# EAGLE design nrf52832bob (EAGLE 7.4.0)
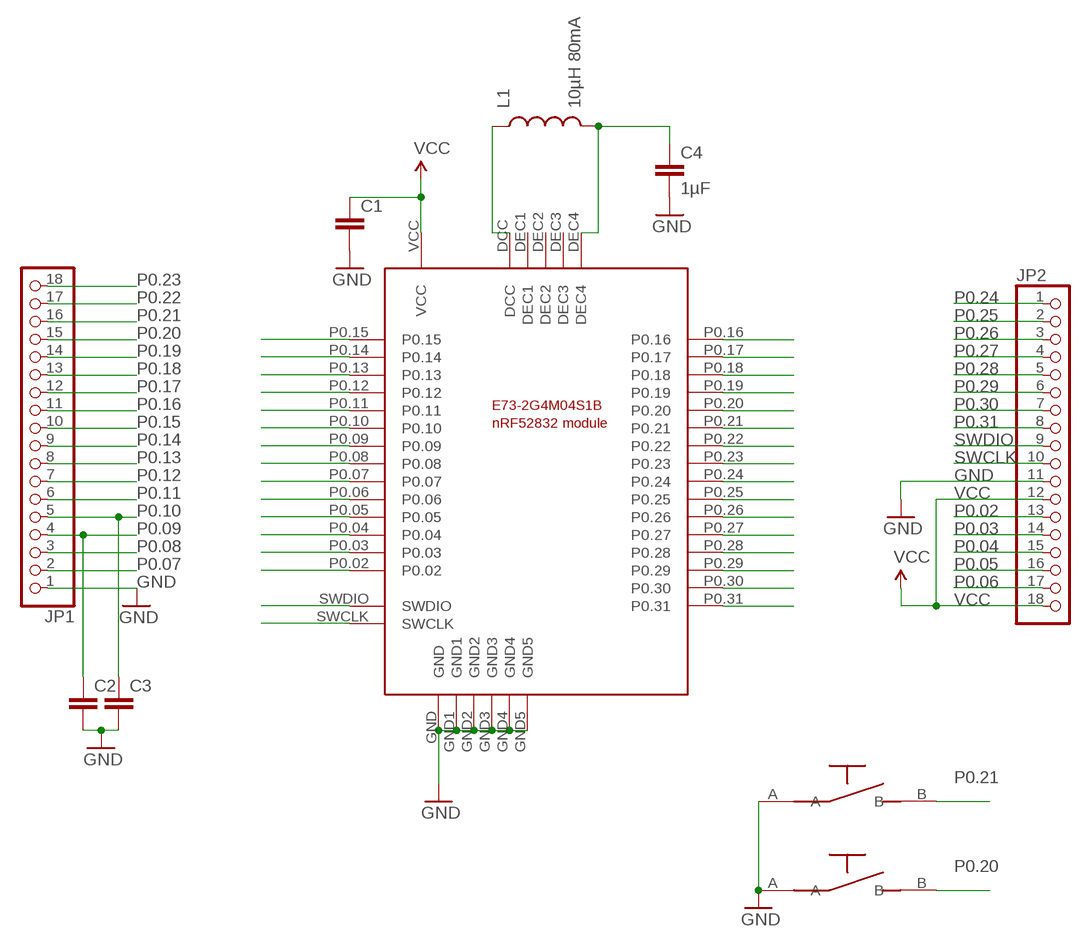
[diagram p0: schematic, sheet 1]

## Parts
C1  C-EUC0805  [C0805]
C2  C-EUC0603  [C0603]
C3  C-EUC0603  [C0603]
C4  1µF  C-EUC0603  [C0603]
JP1  PINHD-1X18-BIG  [1X18-BIG]
JP2  PINHD-1X18-BIG  [1X18-BIG]
L1  10µH 80mA  INDUCTOR0603  [0603]
U$1  NRF52832MODULE  [NRF52832MODULE]
U$2  SWITCH2PIN  [SWITCH2PIN]
U$3  SWITCH2PIN  [SWITCH2PIN]

## Nets
GND: C1.2 C2.2 C3.2 C4.2 JP1.1 JP2.11 U$1.GND U$1.GND1 U$1.GND2 U$1.GND3 U$1.GND4 U$1.GND5 U$2.A U$3.A
N$1: L1.1 U$1.DCC
N$2: C4.1 L1.2 U$1.DEC4
P0.02: JP2.13 U$1.P0.02
P0.03: JP2.14 U$1.P0.03
P0.04: JP2.15 U$1.P0.04
P0.05: JP2.16 U$1.P0.05
P0.06: JP2.17 U$1.P0.06
P0.07: JP1.2 U$1.P0.07
P0.08: JP1.3 U$1.P0.08
P0.09: C2.1 JP1.4 U$1.P0.09
P0.10: C3.1 JP1.5 U$1.P0.10
P0.11: JP1.6 U$1.P0.11
P0.12: JP1.7 U$1.P0.12
P0.13: JP1.8 U$1.P0.13
P0.14: JP1.9 U$1.P0.14
P0.15: JP1.10 U$1.P0.15
P0.16: JP1.11 U$1.P0.16
P0.17: JP1.12 U$1.P0.17
P0.18: JP1.13 U$1.P0.18
P0.19: JP1.14 U$1.P0.19
P0.20: JP1.15 U$1.P0.20 U$3.B
P0.21: JP1.16 U$1.P0.21 U$2.B
P0.22: JP1.17 U$1.P0.22
P0.23: JP1.18 U$1.P0.23
P0.24: JP2.1 U$1.P0.24
P0.25: JP2.2 U$1.P0.25
P0.26: JP2.3 U$1.P0.26
P0.27: JP2.4 U$1.P0.27
P0.28: JP2.5 U$1.P0.28
P0.29: JP2.6 U$1.P0.29
P0.30: JP2.7 U$1.P0.30
P0.31: JP2.8 U$1.P0.31
SWCLK: JP2.10 U$1.SWCLK
SWDIO: JP2.9 U$1.SWDIO
VCC: C1.1 JP2.12 JP2.18 U$1.VCC
Unconnected: U$1.DEC1 U$1.DEC2 U$1.DEC3

## Library data of the parts
C1-C4 = rcl:C-EU: CAPACITOR, European symbol
JP1 JP2 = adafruit:PINHD-1X18: PIN HEADER
L1 = SparkFun-Passives:INDUCTOR: Inductors Basic Inductor/Choke - 0603 and 1206. Footprints are not proven and vary greatly between part numbers. INDUCTOR POWER 3.3UH 4.0A SMD 0.197" L x 0.197" W x 0.177" H (5.00mm x 5.00mm x 4.50mm)
U$1 = nrf52832module:NRF52832MODULE
U$2 U$3 = switch2pin:SWITCH2PIN

## Board
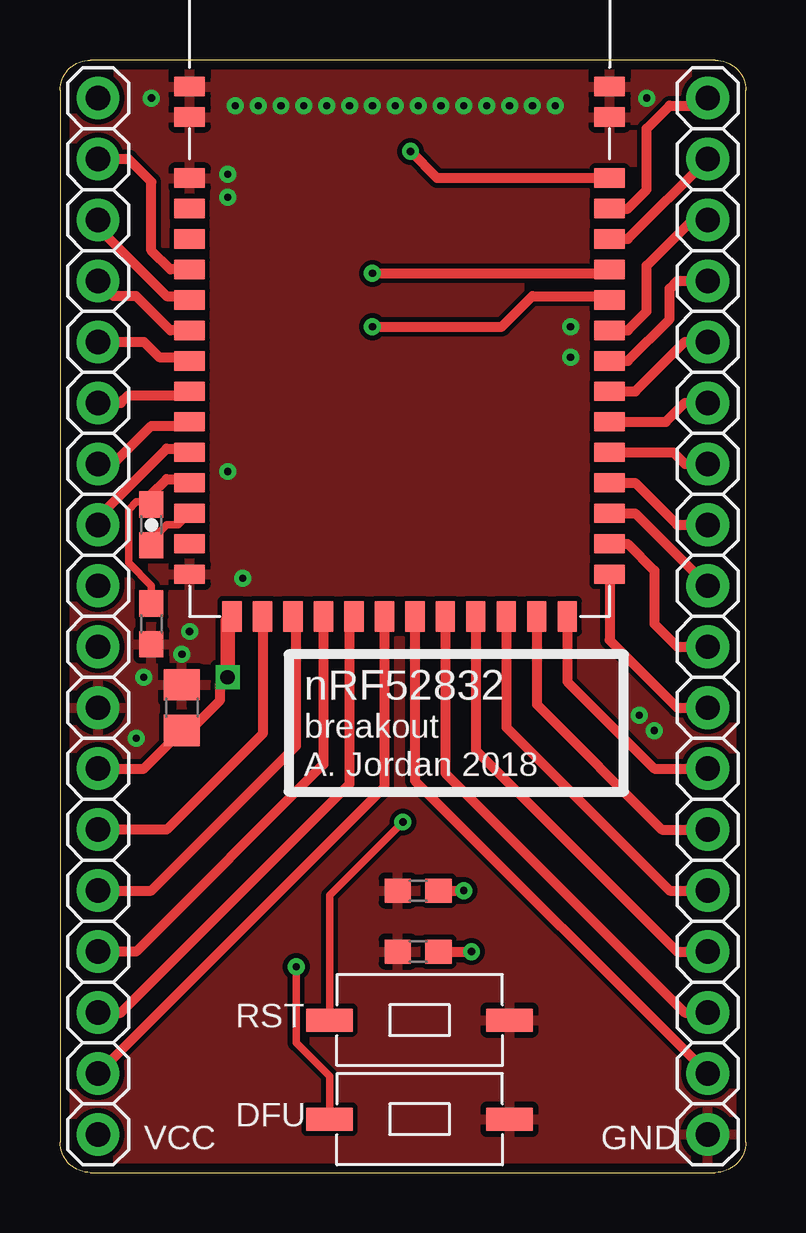
[diagram p1: board, top side]
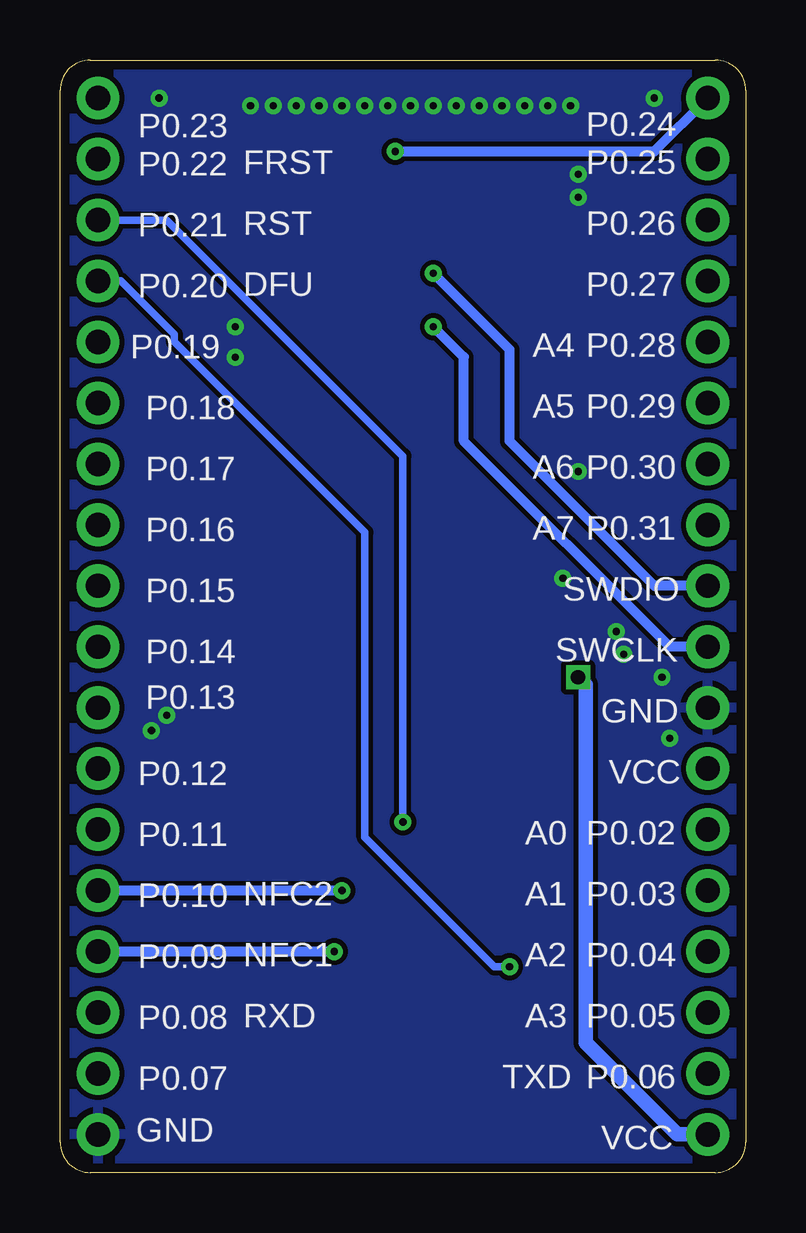
[diagram p2: board, bottom side, seen from below]

Size 28.57 x 46.35 mm. Coordinates in mm from the lower left corner, seen from the top.
Outline: 1.27,0 27.31,0 arc90 28.57,1.27 28.57,45.09 arc90 27.31,46.35 1.27,46.35 arc90 0,45.09 0,1.27 arc90 1.27,0
Copper layers (1*16): Top 0.035mm / dielectric 1.5mm / Bottom 0.035mm
Design rules "default *": minimum track width 10mil, minimum drill 24mil, track to track 8mil, track to pad 8mil, pad to pad 8mil, via to via 8mil, smd to smd 8mil, copper to edge 15mil, drill to drill 8mil, minimum pad ring 10mil, minimum via ring 8mil, stop-mask expansion 4mil, vias tented up to drill 20mil, thermal gap 10mil

### Footprints (pad centres in the part's own frame; a part is rotated, then mirrored left to right if it is on the bottom)
C0805 = smd 1.3 x 1.5: 1 -0.95,0; 2 0.95,0
C0603 = smd 1.1 x 1: 1 -0.85,0; 2 0.85,0
1X18-BIG = drill 1.016 pad 1.778: 1 -21.59,0; 2 -19.05,0; 3 -16.51,0; 4 -13.97,0; 5 -11.43,0; 6 -8.89,0; 7 -6.35,0; 8 -3.81,0; 9 -1.27,0; 10 1.27,0; 11 3.81,0; 12 6.35,0; 13 8.89,0; 14 11.43,0; 15 13.97,0; 16 16.51,0; 17 19.05,0; 18 21.59,0
0603 = smd 1.1 x 1: 1 -0.85,0; 2 0.85,0
NRF52832MODULE = smd 1.27 x 0.8: DCC 0,4.29; DEC1 0,3.02; DEC2 0,16.99; DEC3 0,15.72; DEC4 0,5.56; GND 0,22.07; GND1 0,20.8; GND2 0,18.26; GND3 0,1.75; GND4 17.5,20.8; GND5 17.5,22.07; P0.13 17.5,1.75; P0.14 17.5,3.02; P0.15 17.5,4.29; P0.16 17.5,5.56; P0.17 17.5,6.83; P0.18 17.5,8.1; P0.19 17.5,9.37; P0.20 17.5,10.64; P0.21 17.5,11.91; P0.22 17.5,15.72; P0.23 17.5,16.99; P0.24 17.5,18.26; P0.25 0,14.45; P0.26 0,13.18; P0.27 0,11.91; P0.28 0,10.64; P0.29 0,9.37; P0.30 0,8.1; P0.31 0,6.83; SWCLK 17.5,13.18; SWDIO 17.5,14.45 | smd 0.8 x 1.27: P0.02 3.04,0; P0.03 4.31,0; P0.04 5.58,0; P0.05 6.85,0; P0.06 8.12,0; P0.07 9.39,0; P0.08 10.66,0; P0.09 11.93,0; P0.10 13.2,0; P0.11 14.47,0; P0.12 15.74,0; VCC 1.77,0
SWITCH2PIN = smd 1.93 x 0.965: A 0,0; B 7.5,0

### Placement (x,y rotation side)
C1  5.08,19.37 90 top
C2  14.92,9.21 180 top
C3  14.92,11.75 180 top
C4  3.81,22.86 270 top
JP1  26.99,23.18 90 top
JP2  1.59,23.18 270 top
L1  3.81,26.99 90 top
U$1  5.4,23.18 0 top
U$2  18.73,6.35 180 top
U$3  18.73,2.22 180 top

### Tracks (layer width: path | path; a pad name or v marks a point on that pad's centre or on a via)
GND  (via drill 0.3)
  other vias: 7.3,44.45 8.25,44.45 9.21,44.45 10.16,44.45 11.11,44.45 12.06,44.45 13.02,44.45 13.97,44.45 14.92,44.45 15.88,44.45 16.83,44.45 17.78,44.45 18.73,44.45 19.68,44.45 20.64,44.45 24.45,44.77 3.81,44.77 3.18,18.1 5.4,22.54 7.62,24.77 6.99,29.21 24.13,19.05 24.77,18.41 21.27,35.24 21.27,33.97 6.99,41.59 6.99,40.64 5.08,21.59 3.49,20.64
  pour Bottom: -0.95,46.67 -1.59,46.67 -1.59,-1.9 29.53,-1.9 29.53,46.35 29.53,46.67
  pour Top: -2.86,47.62 -3.18,47.62 -3.18,-2.86 31.12,-2.86 31.12,46.99 31.12,47.62
N$1
  Top 0.305: L1.1 3.81,26.35 4.44,26.99 4.92,26.99 U$1.DCC
N$2
  Top 0.305: C4.1 3.81,24.45 2.86,25.4 2.86,27.62 3.18,27.94 3.71,27.94 L1.2
  Top 0.406: L1.2 3.81,28.26 4.44,28.89 5.24,28.89 U$1.DEC4
P0.02
  Top 0.406: U$1.P0.02 8.44,18.28 4.44,14.29 JP2.13 | JP2.13 1.27,14.29 0.95,13.97 1.27,13.97 JP2.13
P0.03
  Top 0.406: JP2.14 3.81,11.75 9.84,17.78 9.84,23.04 U$1.P0.03
P0.04
  Top 0.406: U$1.P0.04 10.98,17.01 3.18,9.21 JP2.15
P0.05
  Top 0.406: JP2.16 2.54,6.67 12.07,16.19 12.07,22.99 U$1.P0.05
P0.06
  Top 0.406: U$1.P0.06 13.52,16.06 JP2.17
P0.07
  Top 0.406: U$1.P0.07 14.79,16.33 JP1.2
P0.08
  Top 0.406: U$1.P0.08 16.06,16.65 26.04,6.67 JP1.3
P0.09  (via drill 0.3)
  Top 0.406: U$1.P0.09 17.33,17.6 25.72,9.21 JP1.4 | C2.1 v17.15,9.21
  Bottom 0.406: v17.15,9.21 JP1.4
P0.10  (via drill 0.3)
  Top 0.406: U$1.P0.10 18.6,18.55 25.4,11.75 JP1.5 | C3.1 v16.83,11.75
  Bottom 0.406: v16.83,11.75 JP1.5
P0.11
  Top 0.406: U$1.P0.11 19.87,19.5 25.08,14.29 JP1.6
P0.12
  Top 0.406: U$1.P0.12 21.14,20.45 24.77,16.83 JP1.7
P0.13
  Top 0.406: U$1.P0.13 22.9,22.19 25.72,19.37 JP1.8
P0.14
  Top 0.406: U$1.P0.14 23.65,26.2 24.77,25.08 24.77,22.86 25.72,21.91 JP1.9
P0.15
  Top 0.406: U$1.P0.15 23.97,27.47 JP1.10
P0.16
  Top 0.406: U$1.P0.16 23.97,28.74 25.72,26.99 JP1.11
P0.17
  Top 0.406: U$1.P0.17 25.56,30.01 26.04,29.53 JP1.12
P0.18
  Top 0.406: U$1.P0.18 25.25,31.28 26.04,32.07 JP1.13
P0.19
  Top 0.406: U$1.P0.19 23.97,32.55 26.04,34.61 JP1.14
P0.20  (via drill 0.3)
  Top 0.305: U$3.B 11.23,4.01 9.84,5.4 v9.84,8.57
  Top 0.406: U$1.P0.20 23.66,33.82 25.4,35.56 25.4,36.83 25.72,37.15 JP1.15
  Bottom 0.305: v9.84,8.57 10.48,8.57 15.88,13.97 15.88,26.67 23.81,34.61 23.81,34.92 26.04,37.15 JP1.15
P0.21  (via drill 0.3)
  Top 0.305: U$2.B 11.23,11.55 v14.29,14.6
  Top 0.406: U$1.P0.21 23.66,35.09 24.45,35.88 24.45,37.78 26.35,39.69 JP1.16
  Bottom 0.305: v14.29,14.6 14.29,29.85 24.13,39.69 JP1.16
P0.22
  Top 0.406: U$1.P0.22 23.66,38.9 JP1.17
P0.23
  Top 0.406: U$1.P0.23 23.66,40.17 24.45,40.96 24.45,43.5 25.4,44.45 26.67,44.45 JP1.18
P0.24  (via drill 0.3)
  Top 0.406: U$1.P0.24 15.71,41.44 v14.6,42.55
  Bottom 0.406: v14.6,42.55 3.81,42.55 JP2.1
P0.25
  Top 0.406: U$1.P0.25 4.6,37.63 3.81,38.42 3.81,41.28 2.86,42.23 JP2.2
P0.26
  Top 0.406: JP2.3 1.59,39.37 4.44,36.51 5.24,36.51 U$1.P0.26
P0.27
  Top 0.406: U$1.P0.27 4.6,35.09 3.18,36.51 2.22,36.51 JP2.4
P0.28
  Top 0.406: JP2.5 3.49,34.61 4.13,33.97 5.24,33.97 U$1.P0.28
P0.29
  Top 0.406: JP2.6 2.54,32.07 2.86,32.38 5.24,32.38 U$1.P0.29
P0.30
  Top 0.406: JP2.7 2.22,29.53 3.81,31.11 5.24,31.11 U$1.P0.30
P0.31
  Top 0.406: JP2.8 1.59,27.31 4.44,30.16 5.24,30.16 U$1.P0.31
SWCLK  (via drill 0.3)
  Top 0.406: v13.02,35.24 18.41,35.24 19.68,36.51 22.74,36.51 U$1.SWCLK
  Bottom 0.406: JP2.10 3.18,21.91 11.75,30.48 11.75,33.97 v13.02,35.24
SWDIO  (via drill 0.3)
  Top 0.406: v13.02,37.46 22.74,37.46 U$1.SWDIO
  Bottom 0.406: JP2.9 3.81,24.45 9.84,30.48 9.84,34.29 v13.02,37.46
VCC  (via drill 0.6)
  Top 0.406: JP2.12 3.49,16.83 C1.1 5.4,18.42 6.67,19.69 6.67,20.32 v6.99,20.64
  Top 0.61: v6.99,20.64 6.99,22.99 U$1.VCC
  Bottom 0.61: JP2.18 2.86,1.59 6.67,5.4 6.67,20.32 v6.99,20.64

### Text on the board
tPlace: nRF52832 | breakout | A. Jordan 2018 | RST | DFU | VCC | GND
bPlace: P0.23 | P0.24 | P0.22 | P0.25 | FRST | P0.21 | P0.26 | RST | P0.20 | P0.27 | DFU | P0.19 | P0.28 | A4 | P0.18 | P0.29 | A5 | P0.17 | P0.30 | A6 | P0.16 | P0.31 | A7 | P0.15 | SWDIO | P0.14 | SWCLK | P0.13 | GND | P0.12 | VCC | P0.02 | A0 | P0.11 | P0.10 | P0.03 | A1 | NFC2 | P0.09 | P0.04 | A2 | NFC1 | P0.08 | P0.05 | A3 | RXD | P0.07 | P0.06 | TXD | VCC | GND